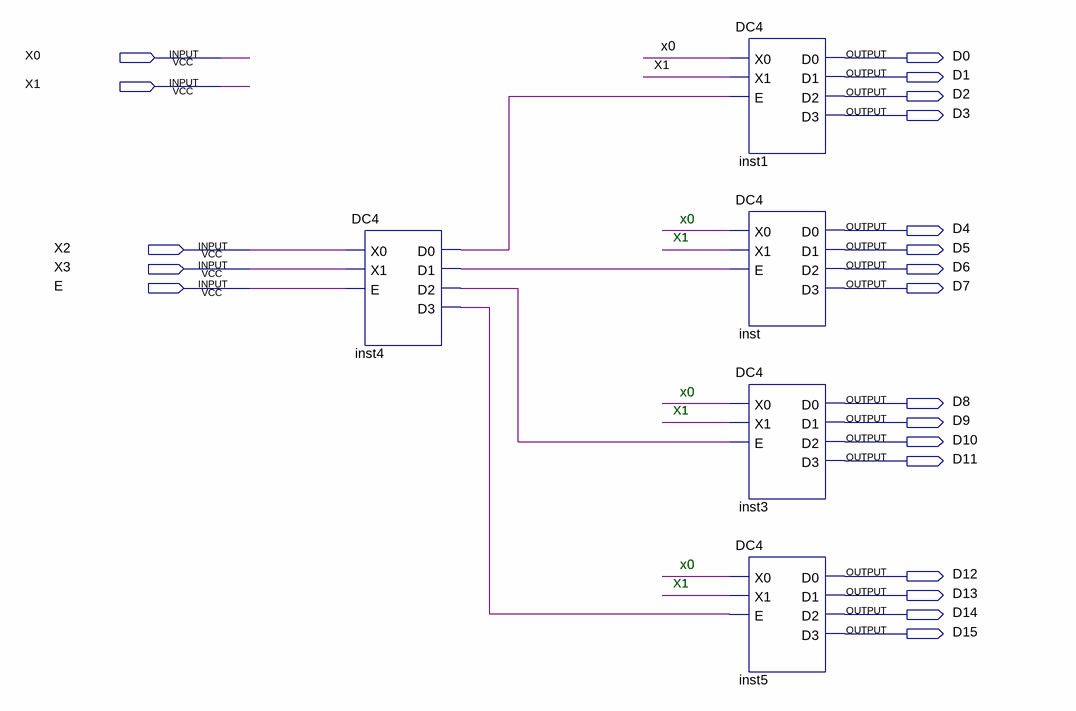
[diagram p0: schematic sheet]
// Quartus schematic DC16.bdf as structural Verilog: 5 symbols, 21 pins
module DC16 (
  input  X0,
  input  X1,
  input  X2,
  input  X3,
  input  E,
  output D0,
  output D1,
  output D2,
  output D3,
  output D4,
  output D5,
  output D6,
  output D7,
  output D8,
  output D9,
  output D10,
  output D11,
  output D12,
  output D13,
  output D14,
  output D15
);

  wire inst4_d0, inst4_d1, inst4_d2, inst4_d3;

  DC4 inst4 (.X0(X2), .X1(X3), .E(E), .D0(inst4_d0), .D1(inst4_d1), .D2(inst4_d2), .D3(inst4_d3));
  DC4 inst1 (.X0(X0), .X1(X1), .E(inst4_d0), .D0(D0), .D1(D1), .D2(D2), .D3(D3));
  DC4 inst (.X0(X0), .X1(X1), .E(inst4_d1), .D0(D4), .D1(D5), .D2(D6), .D3(D7));
  DC4 inst3 (.X0(X0), .X1(X1), .E(inst4_d2), .D0(D8), .D1(D9), .D2(D10), .D3(D11));
  DC4 inst5 (.X0(X0), .X1(X1), .E(inst4_d3), .D0(D12), .D1(D13), .D2(D14), .D3(D15));

  // Notes on the sheet:
  //   x0
  //   X1
  //   x0
  //   X1
  //   x0
  //   X1
endmodule
